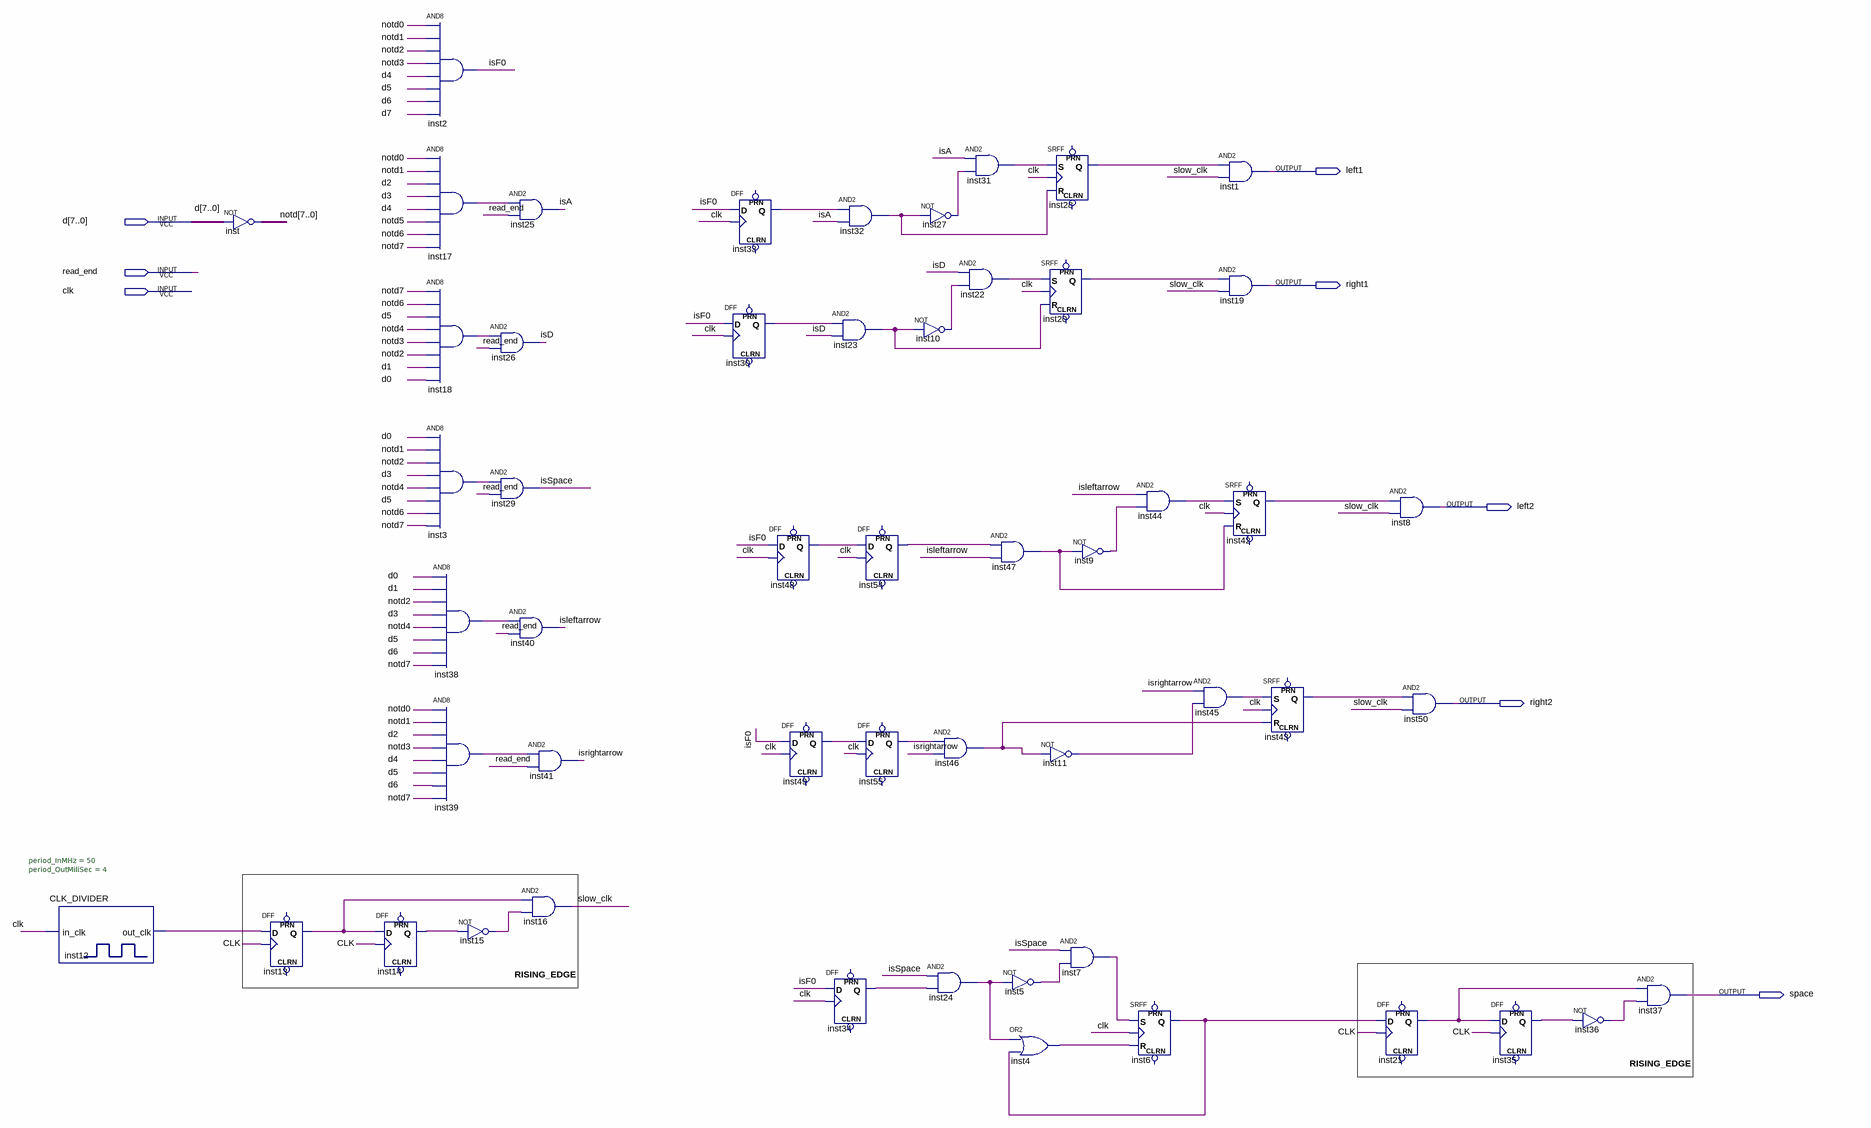
[diagram p0: schematic sheet]
// Quartus schematic KeyDetector1.bdf as structural Verilog: 53 symbols, 8 pins
module KeyDetector1 (
  input  [7:0] d,
  input  read_end,
  input  clk,
  output left1,
  output right1,
  output left2,
  output right2,
  output space
);

  wire inst3_out, inst4_out, inst5_out, inst6_q, inst7_out, inst9_out, inst10_out, inst11_out,
       inst12_out_clk, inst13_q, inst14_q, inst15_out, inst17_out, inst18_out, inst20_q, inst21_q,
       inst22_out, inst23_out, inst24_out, inst27_out, inst28_q, inst30_q, inst31_out, inst32_out, inst33_q,
       inst34_q, inst35_q, inst36_out, inst38_out, inst39_out, inst42_q, inst43_q, inst44_out, inst45_out,
       inst46_out, inst47_out, inst48_q, inst49_q, inst54_q, inst55_q, isA, isD, isF0, isleftarrow,
       isrightarrow, isSpace, slow_clk;
  wire [7:0] notd;

  CLK_DIVIDER #(.period_InMHz(50), .period_OutMiliSec(4)) inst12 (.in_clk(clk), .out_clk(inst12_out_clk));
  assign notd = ~d;  // NOT inst, 8 bits wide
  DFF inst13 (.CLK(clk), .D(inst12_out_clk), .Q(inst13_q));  // open: CLRN, PRN
  DFF inst14 (.CLK(clk), .D(inst13_q), .Q(inst14_q));  // open: CLRN, PRN
  and inst2 (isF0, notd[0], notd[1], notd[2], notd[3], d[4], d[5], d[6], d[7]);
  and inst17 (inst17_out, notd[0], notd[1], d[2], d[3], d[4], notd[5], notd[6], notd[7]);
  and inst18 (inst18_out, notd[7], notd[6], d[5], notd[4], notd[3], notd[2], d[1], d[0]);
  and inst3 (inst3_out, d[0], notd[1], notd[2], d[3], notd[4], d[5], notd[6], notd[7]);
  and inst38 (inst38_out, d[0], d[1], notd[2], d[3], notd[4], d[5], d[6], notd[7]);
  and inst39 (inst39_out, notd[0], notd[1], d[2], notd[3], d[4], d[5], d[6], notd[7]);
  and inst26 (isD, inst18_out, read_end);
  and inst29 (isSpace, inst3_out, read_end);
  not inst15 (inst15_out, inst14_q);
  and inst25 (isA, inst17_out, read_end);
  and inst40 (isleftarrow, inst38_out, read_end);
  and inst41 (isrightarrow, inst39_out, read_end);
  and inst16 (slow_clk, inst13_q, inst15_out);
  DFF inst33 (.CLK(clk), .D(isF0), .Q(inst33_q));  // open: CLRN, PRN
  DFF inst30 (.CLK(clk), .D(isF0), .Q(inst30_q));  // open: CLRN, PRN
  DFF inst48 (.CLK(clk), .D(isF0), .Q(inst48_q));  // open: CLRN, PRN
  DFF inst49 (.CLK(clk), .D(isF0), .Q(inst49_q));  // open: CLRN, PRN
  and inst32 (inst32_out, inst33_q, isA);
  and inst23 (inst23_out, inst30_q, isD);
  DFF inst34 (.CLK(clk), .D(isF0), .Q(inst34_q));  // open: CLRN, PRN
  DFF inst54 (.CLK(clk), .D(inst48_q), .Q(inst54_q));  // open: CLRN, PRN
  DFF inst55 (.CLK(clk), .D(inst49_q), .Q(inst55_q));  // open: CLRN, PRN
  not inst27 (inst27_out, inst32_out);
  not inst10 (inst10_out, inst23_out);
  and inst46 (inst46_out, inst55_q, isrightarrow);
  and inst24 (inst24_out, isSpace, inst34_q);
  and inst31 (inst31_out, isA, inst27_out);
  and inst22 (inst22_out, isD, inst10_out);
  and inst47 (inst47_out, inst54_q, isleftarrow);
  SRFF inst28 (.S(inst31_out), .R(inst32_out), .CLK(clk), .Q(inst28_q));  // open: PRN, CLRN
  SRFF inst20 (.S(inst22_out), .R(inst23_out), .CLK(clk), .Q(inst20_q));  // open: PRN, CLRN
  not inst11 (inst11_out, inst46_out);
  not inst5 (inst5_out, inst24_out);
  or inst4 (inst4_out, inst24_out, inst6_q);
  not inst9 (inst9_out, inst47_out);
  and inst7 (inst7_out, isSpace, inst5_out);
  and inst44 (inst44_out, isleftarrow, inst9_out);
  SRFF inst6 (.S(inst7_out), .R(inst4_out), .CLK(clk), .Q(inst6_q));  // open: PRN, CLRN
  and inst45 (inst45_out, isrightarrow, inst11_out);
  and inst1 (left1, inst28_q, slow_clk);
  and inst19 (right1, inst20_q, slow_clk);
  SRFF inst42 (.S(inst44_out), .R(inst47_out), .CLK(clk), .Q(inst42_q));  // open: PRN, CLRN
  SRFF inst43 (.S(inst45_out), .R(inst46_out), .CLK(clk), .Q(inst43_q));  // open: PRN, CLRN
  and inst8 (left2, inst42_q, slow_clk);
  and inst50 (right2, inst43_q, slow_clk);
  DFF inst21 (.CLK(clk), .D(inst6_q), .Q(inst21_q));  // open: CLRN, PRN
  DFF inst35 (.CLK(clk), .D(inst21_q), .Q(inst35_q));  // open: CLRN, PRN
  not inst36 (inst36_out, inst35_q);
  and inst37 (space, inst21_q, inst36_out);

  // Notes on the sheet:
  //   RISING_EDGE
  //   RISING_EDGE
endmodule
